# Altium schematic sheet Interfaces.SchDoc
size A4
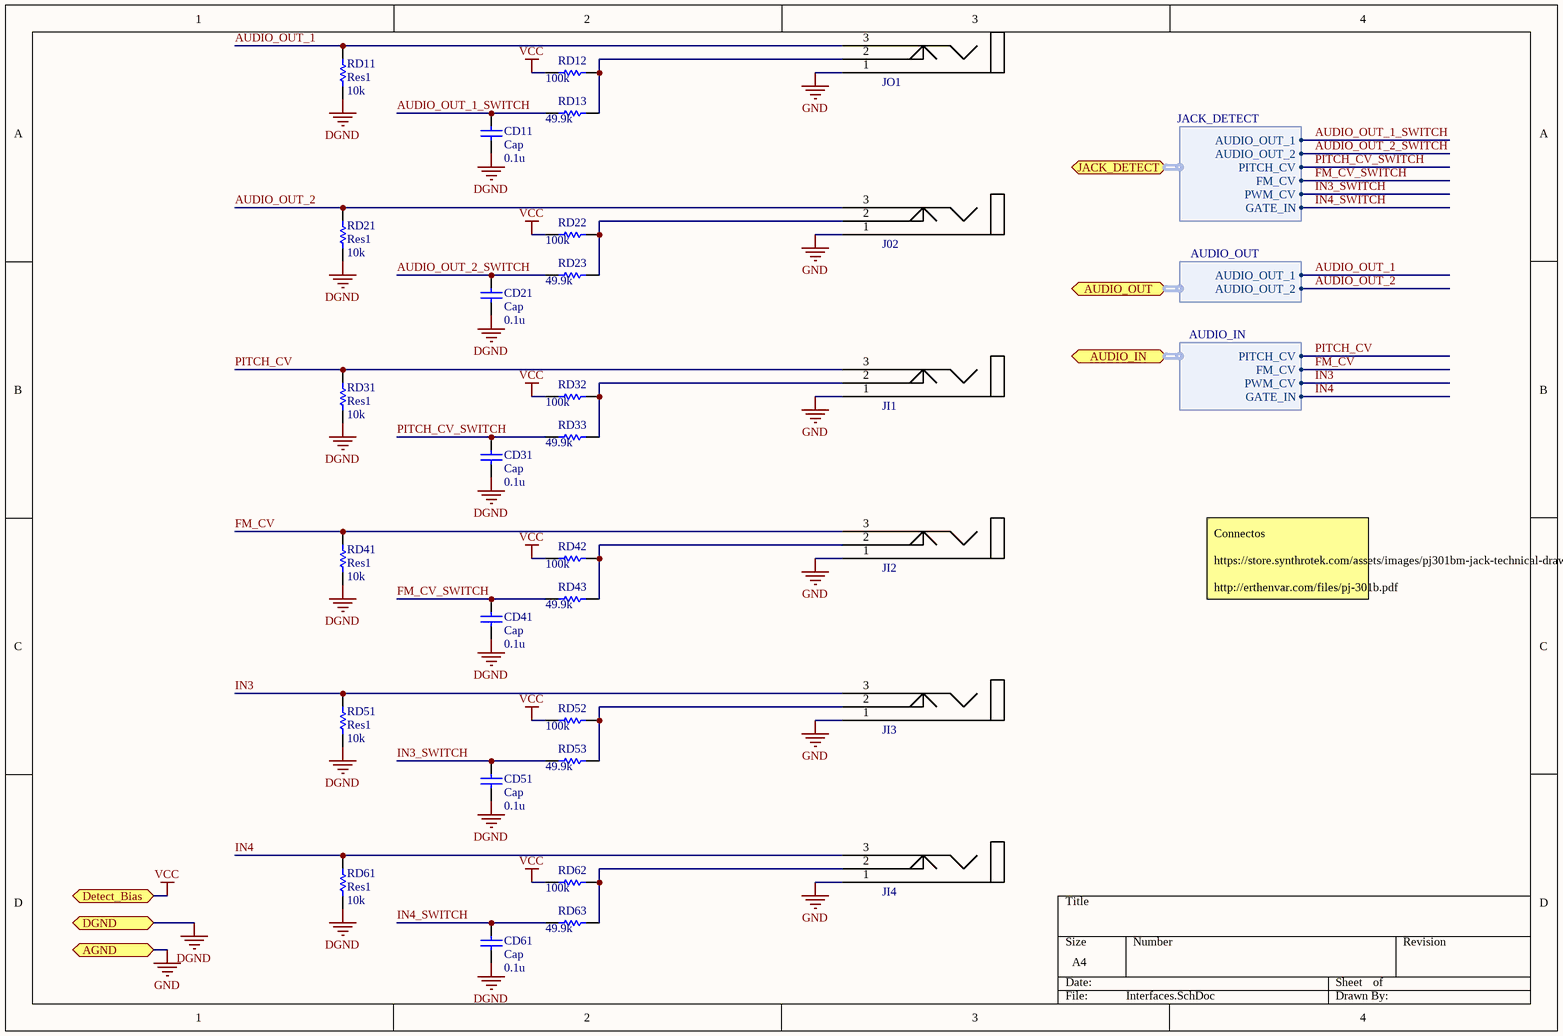
[diagram p0: Interfaces.SchDoc]

## Parts
CD11  Cap  value 0.1u  [C 0603 / 1608]
CD21  Cap  value 0.1u  [C 0603 / 1608]
CD31  Cap  value 0.1u  [C 0603 / 1608]
CD41  Cap  value 0.1u  [C 0603 / 1608]
CD51  Cap  value 0.1u  [C 0603 / 1608]
CD61  Cap  value 0.1u  [C 0603 / 1608]
J02  PJ-301  [PJ-301BM]  (value not drawn)
JI1  PJ-301  [PJ-301BM]  (value not drawn)
JI2  PJ-301  [PJ-301BM]  (value not drawn)
JI3  PJ-301  [PJ-301BM]  (value not drawn)
JI4  PJ-301  [PJ-301BM]  (value not drawn)
JO1  PJ-301  [PJ-301BM]  (value not drawn)
RD11  Res1  value 10k  [RES0603R]
RD12  value 100k  [RES0603R]  (hidden comment: Res1)
RD13  value 49.9k  [RES0603R]  (hidden comment: Res1)
RD21  Res1  value 10k  [RES0603R]
RD22  value 100k  [RES0603R]  (hidden comment: Res1)
RD23  value 49.9k  [RES0603R]  (hidden comment: Res1)
RD31  Res1  value 10k  [RES0603R]
RD32  value 100k  [RES0603R]  (hidden comment: Res1)
RD33  value 49.9k  [RES0603R]  (hidden comment: Res1)
RD41  Res1  value 10k  [RES0603R]
RD42  value 100k  [RES0603R]  (hidden comment: Res1)
RD43  value 49.9k  [RES0603R]  (hidden comment: Res1)
RD51  Res1  value 10k  [RES0603R]
RD52  value 100k  [RES0603R]  (hidden comment: Res1)
RD53  value 49.9k  [RES0603R]  (hidden comment: Res1)
RD61  Res1  value 10k  [RES0603R]
RD62  value 100k  [RES0603R]  (hidden comment: Res1)
RD63  value 49.9k  [RES0603R]  (hidden comment: Res1)

## Ports
AGND (bidir), AUDIO_IN (bidir, harness AUDIO_IN), AUDIO_OUT (bidir, harness AUDIO_OUT), Detect_Bias (bidir), DGND (bidir), JACK_DETECT (bidir, harness JACK_DETECT)

## Harnesses
JACK_DETECT: AUDIO_OUT_1, AUDIO_OUT_2, PITCH_CV, FM_CV, PWM_CV, GATE_IN
AUDIO_OUT: AUDIO_OUT_1, AUDIO_OUT_2
AUDIO_IN: PITCH_CV, FM_CV, PWM_CV, GATE_IN

## Nets
DGND: CD11.1 CD21.1 CD31.1 CD41.1 CD51.1 CD61.1 RD11.1 RD21.1 RD31.1 RD41.1 RD51.1 RD61.1 ; port DGND
GND: J02.1(Sleeve) JI1.1(Sleeve) JI2.1(Sleeve) JI3.1(Sleeve) JI4.1(Sleeve) JO1.1(Sleeve) ; port AGND
VCC: RD12.2 RD22.2 RD32.2 RD42.2 RD52.2 RD62.2 ; port Detect_Bias
AUDIO_OUT_1: JO1.3(Ring) RD11.2 ; port AUDIO_OUT.AUDIO_OUT_1
AUDIO_OUT_1_SWITCH: CD11.2 RD13.2 ; port JACK_DETECT.AUDIO_OUT_1
AUDIO_OUT_2: J02.3(Ring) RD21.2 ; port AUDIO_OUT.AUDIO_OUT_2
AUDIO_OUT_2_SWITCH: CD21.2 RD23.2 ; port JACK_DETECT.AUDIO_OUT_2
FM_CV: JI2.3(Ring) RD41.2 ; port AUDIO_IN.FM_CV
FM_CV_SWITCH: CD41.2 RD43.2 ; port JACK_DETECT.FM_CV
IN3: JI3.3(Ring) RD51.2 ; port AUDIO_IN.PWM_CV
IN3_SWITCH: CD51.2 RD53.2 ; port JACK_DETECT.PWM_CV
IN4: JI4.3(Ring) RD61.2 ; port AUDIO_IN.GATE_IN
IN4_SWITCH: CD61.2 RD63.2 ; port JACK_DETECT.GATE_IN
PITCH_CV: JI1.3(Ring) RD31.2 ; port AUDIO_IN.PITCH_CV
PITCH_CV_SWITCH: CD31.2 RD33.2 ; port JACK_DETECT.PITCH_CV
NetJ02_2: J02.2(Tip) RD22.1 RD23.1
NetJI1_2: JI1.2(Tip) RD32.1 RD33.1
NetJI2_2: JI2.2(Tip) RD42.1 RD43.1
NetJI3_2: JI3.2(Tip) RD52.1 RD53.1
NetJI4_2: JI4.2(Tip) RD62.1 RD63.1
NetJO1_2: JO1.2(Tip) RD12.1 RD13.1

## Notes on the sheet
- Connectos
  https://store.synthrotek.com/assets/images/pj301bm-jack-technical-drawing.jpg
  http://erthenvar.com/files/pj-301b.pdf

## Library data of the parts
CD11 CD21 CD31 CD41 CD51 CD61 = Cap: Capacitor; Published: 8-Jun-2000; LatestRevisionDate: 17-Jul-2002; LatestRevisionNote: Re-released for DXP Platform.; PackageReference: RAD-0.3; Publisher: Altium Limited; PackageDescription: Radial Cap, Thru-Hole; 2 Leads; 0.3 in Pin Spacing
J02 JI1-JI4 JO1 = PJ-301: https://www.snapeda.com/parts/PJ-301BM/Tayda%20Electronics/datasheet/ / https://pt.aliexpress.com/item/32841677168.html?spm=a2g03.12057483.0.0.6dda4aeaXiyjRe / https://lh3.googleusercontent.com/proxy/ZbPfZslDxdj8iWSgzh0kYZVEID9Zfc6SS9ZRHYvUB6heg4eTAyEEOQEiXlT2FamGh3ujXXQ57fTjbGyEKtdVl3hemL66LOj7ZA
RD11-RD13 RD21-RD23 RD31-RD33 RD41-RD43 RD51-RD53 RD61-RD63 = Res1: Resistor; Published: 8-Jun-2000; LatestRevisionDate: 17-Jul-2002; LatestRevisionNote: Re-released for DXP Platform.; PackageReference: AXIAL-0.3; Publisher: Altium Limited; PackageDescription: Axial Device, Thru-Hole; 2 Leads; 0.3 in Pin Spacing